# Altium project iot-gateway.PrjPcb (part 2 of 2)

## Sheet USB.SchDoc
size A4
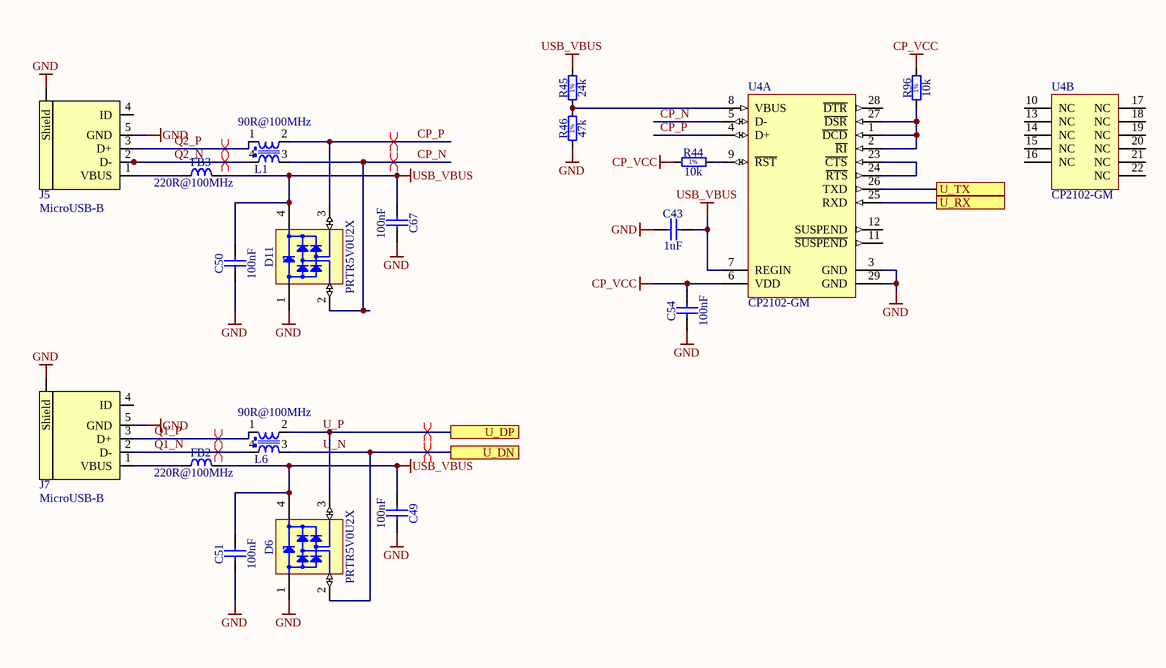
[diagram p4: USB.SchDoc]

### Parts
(Parts that share a designator on the sheet are numbered #1, #2 ... from top to bottom, then left to right.)
C43#1  1uF  [CAPC1005X55N]
C49  100nF  [CAPC1005X55N]
C50  100nF  [CAPC1005X55N]
C51  100nF  [CAPC1005X55N]
C54  100nF  [CAPC1005X55N]
C67  100nF  [CAPC1005X55N]
D6  PRTR5V0U2X  [SOT190P230X110-4N]
D11  PRTR5V0U2X  [SOT190P230X110-4N]
FB2  220R@100MHz  [INDC2012X105N]
FB3  220R@100MHz  [INDC2012X105N]
J5  MicroUSB-B  [USB-Micro-B-RA-SMD-PiP]
J7  MicroUSB-B  [USB-Micro-B-RA-SMD-PiP]
L1  90R@100MHz  [IND_MURATA_DLW21S]
L6  90R@100MHz  [IND_MURATA_DLW21S]
R44  10k  [RESC1005X40N]
R45  24k  [RESC1005X40N]
R46  47k  [RESC1005X40N]
R96  10k  [RESC1005X40N]
U4  CP2102-GM  [SLAB-QFN-28-3125x3125TP_N]  (parts A,B of 2)

### Ports
U_DN, U_DP, U_RX, U_TX

### Nets
CP_VCC: C54.2 R44.1 R96.2 U4.6(VDD)
GND: C43#1.1 C49.2 C50.1 C51.1 C54.1 C67.2 D6.1(GND) D11.1(GND) J5.5(GND) J5.6(Shield) J7.5(GND) J7.6(Shield) R46.1 U4.3(GND) U4.29(GND)
USB_VBUS: C43#1.2 C49.1 C50.2 C51.2 C67.1 D6.4(VCC) D11.4(VCC) FB2.2 FB3.2 R45.2 U4.7(REGIN)
CP_N: D11.2(I/O1) L1.3 U4.5(D-)
CP_P: D11.3(I/O2) L1.2 U4.4(D+)
Q1_N: J7.2(D-) L6.4
Q1_P: J7.3(D+) L6.1
Q2_N: J5.2(D-) L1.4
Q2_P: J5.3(D+) L1.1
U_N: D6.2(I/O1) L6.3 ; port U_DN
U_P: D6.3(I/O2) L6.2 ; port U_DP
NetFB2_1: FB2.1 J7.1(VBUS)
NetFB3_1: FB3.1 J5.1(VBUS)
NetR43_2: U4.26(TXD) ; port U_TX
NetR44_2: R44.2 U4.9(~{RST})
NetR45_1: R45.1 R46.2 U4.8(VBUS)
NetR62_1: U4.25(RXD) ; port U_RX
NetR96_1: R96.1 U4.1(~{DCD}) U4.2(~{RI}) U4.27(~{DSR})
NetU4_23: U4.23(~{CTS}) U4.24(~{RTS})

Not connected (* = marked no-connect by the designer): J5 4(ID); J7 4(ID); U4 10(NC) 11(~{SUSPEND}) 12(SUSPEND) 13(NC) 14(NC) 15(NC) 16(NC) 17(NC) 18(NC) 19(NC) 20(NC) 21(NC) 22(NC) 28(~{DTR})

### Layout directives
differential pair: CP_N, CP_P, Q1_N, Q1_P, Q2_N, Q2_P, U_N, U_P

### Notes on the sheet
- (in symbol R0402_10K_1%_0.0625W_100PPM) 1%
- (in symbol R0402_24K_1%_0.0625W_100PPM) 1%
- (in symbol R0402_47K_1%_0.0625W_100PPM) 1%

### Library data of the parts
C43#1 = CC0402_1UF_16V_10%_X5R: Non-polarised capacitor; Part Description: SMD Multilayer Chip Ceramic Capacitor; Manufacturer: GENERIC; Manufacturer1 Part Number: C1005X5R1C105KT; Voltage: 16V; TC: X5R; Tolerance: ±10%; Part Number: CC0402_1UF_16V_10%_X5R; Component Kind: Standard; Component Type: Standard; Pin Count: 2; Value: 1uF; Status: Preferred; Manufacturer Part Number: CC0402_1UF_16V_10%_X5R; Case: 0402; Mounted: Yes; Socket: No; SMD: Yes; Sense: No; Manufacturer1 Example: TDK; Manufacturer1 ComponentHeight: 0.55mm; HelpURL: \\cern.ch\dfs\Applications\Altium\Datasheets\CC0402_X5R_TDK_C.pdf; Author: CERN DEM JLC; CreateDate: 2012-10-25; LatestRevisionDate: 2012-10-25
C49-C51 C54 C67 = CC0402_100NF_16V_10%_X5R: Non-polarised capacitor; Part Description: SMD Multilayer Chip Ceramic Capacitor; Manufacturer: GENERIC; Manufacturer1 Part Number: GRM155R61C104KA88D; Voltage: 16V; TC: X5R; Tolerance: ±10%; Part Number: CC0402_100NF_16V_10%_X5R; Component Kind: Standard; Component Type: Standard; Pin Count: 2; Value: 100nF; Status: None; Manufacturer Part Number: CC0402_100NF_16V_10%_X5R; Case: 0402; Mounted: Yes; Socket: No; SMD: Yes; Sense: No; Manufacturer1 Example: MURATA; Manufacturer1 ComponentHeight: 0.55mm; HelpURL: \\cern.ch\dfs\Applications\Altium\Datasheets\CC0402_X5R_MURATA_GRM.pdf; Author: CERN DEM JLC; CreateDate: 2013-12-10; LatestRevisionDate: 2013-12-10
D6 D11 = PRTR5V0U2X: Ultra Low Capacitance Double Rail-to-Rail ESD Protection Diode; Part Description: Ultra Low Capacitance (1pF) Double Rail-to-Rail ESD Protection Diode (8kV); Manufacturer: NXP SEMICONDUCTORS; Voltage: 5.5V; PressFit: No; Bonding: No; Part Number: PRTR5V0U2X; Component Kind: Standard; Component Type: Standard; Device: PRTR5V0U2X; PackageDescription: SOT143B, SOT, 1.90mm Pitch; 4 Pin, 1.30mm W X 2.90mm L X 1.10mm H body, IPC Medium Density; Manufacturer Part Number: PRTR5V0U2X; Pin Count: 4; Case: SOT143B; Mounted: Yes; Socket: No; SMD: Yes; Sense: No; ComponentHeight: 1.1mm; HelpURL: \\cern.ch\dfs\Applications\Altium\Datasheets\PRTR5V0U2X.pdf; Author: CERN DEM JLC; CreateDate: 22.03.2011; LatestRevisionDate: 22.03.2011
FB2 FB3 = IND0805_MURATA_BLM21PG221SN1D: Inductor; Part Description: SMD EMIFIL Suppression Chip Ferrite Bead; Manufacturer: MURATA; Power: 2A; Resistance: 0.05R; Tolerance: ±25%; Table: Inductors SMD; Part Number: IND0805_MURATA_BLM21PG221SN1D; Component Kind: Standard; Component Type: Standard; Pin Count: 2; Value: 220R@100MHz; Status: None; Manufacturer Part Number: BLM21PG221SN1D; Case: 0805; Mounted: Yes; Socket: No; SMD: Yes; ComponentHeight: 1.05mm; HelpURL: \\cern.ch\dfs\Applications\Altium\Datasheets\IND0402_MURATA_BLM21P.pdf; Author: CERN DEM JLC; CreateDate: 2010-01-25; LatestRevisionDate: 2010-01-25
J5 J7 = USB-Micro-B-RA-SMD-PiP: MicroUSB-B-SMT; Manufacturer: Allen Creations Corp.; Manufacturer Part Number: AJU55-BS2111-L; 2nd source part number: 609-4616-1-ND; Artikkelnr Noca: 55029020; Artikkelnr Simpro: N.A.; Part Number: USB-Micro-B-RA-SMD-PiP; Datasheet: \\hizz\pro\app9717\Datasheet\connectores\Allen Creations Corp\AJU-211.pdf; Footprint Doc: USB-Micro-B-RA-SMD-PiP; LatestRevisionDate: 2016-04-21; Pin Count: 5; Publisher: Nordic Semiconductor; Published: 2014-10-07; Value: MicroUSB-B; Note: *; Supplier: Cabcon; Supplier part number: AJU55-BS2111-L; 2nd source Supplier: Digi-Key
L1 L6 = IND_MURATA_DLW21SN900SQ2L: Inductor Common Mode; Part Description: Wire Wound Common Mode Choke Coil (DLW21S Series); Manufacturer: MURATA; Power: 330mA; Resistance: 0.35R; Tolerance: ±25%; Part Number: IND_MURATA_DLW21SN900SQ2L; Component Kind: Standard; Component Type: Standard; Pin Count: 4; Value: 90R@100MHz; Status: None; Manufacturer Part Number: DLW21SN900SQ2L; Case: 0805; Mounted: Yes; Socket: No; SMD: Yes; Sense: No; ComponentHeight: 1.4mm; HelpURL: \\cern.ch\dfs\Applications\Altium\Datasheets\IND_MURATA_DLW21S.pdf; Author: CERN DEM JLC; CreateDate: 01.07.2014; LatestRevisionDate: 01.07.2014
R44 R96 = R0402_10K_1%_0.0625W_100PPM: Resistor - 1%; Part Description: General Purpose Thick Film Chip Resistor; Manufacturer: GENERIC; Manufacturer1 Part Number: 232270671003L; TC: ±100ppm/°C; Part Number: R0402_10K_1%_0.0625W_100PPM; Component Kind: Standard; Component Type: Standard; Pin Count: 2; Value: 10k; Status: Not recommended; Power: 0.0625W; Tolerance: ±1%; Manufacturer Part Number: R0402_10K_1%_0.0625W_100PPM; Case: 0402; Mounted: Yes; Sense: No; Socket: No; SMD: Yes; Manufacturer1 Example: YAGEO PHYCOMP; Manufacturer1 ComponentHeight: 0.4mm; HelpURL: \\cern.ch\dfs\Applications\Altium\Datasheets\R0402_Phycomp_RC0402.pdf; Author: CERN DEM JLC; CreateDate: 2007-12-03; LatestRevisionDate: 2012-10-17
R45 = R0402_24K_1%_0.0625W_100PPM: Resistor - 1%; Part Description: General Purpose Thick Film Chip Resistor; Manufacturer: GENERIC; Manufacturer1 Part Number: 232270672403L; TC: ±100ppm/°C; Part Number: R0402_24K_1%_0.0625W_100PPM; Component Kind: Standard; Component Type: Standard; Pin Count: 2; Value: 24k; Status: Not recommended; Power: 0.0625W; Tolerance: ±1%; Manufacturer Part Number: R0402_24K_1%_0.0625W_100PPM; Case: 0402; Mounted: Yes; Sense: No; Socket: No; SMD: Yes; Manufacturer1 Example: YAGEO PHYCOMP; Manufacturer1 ComponentHeight: 0.4mm; HelpURL: \\cern.ch\dfs\Applications\Altium\Datasheets\R0402_Phycomp_RC0402.pdf; Author: CERN DEM JLC; CreateDate: 2007-12-03; LatestRevisionDate: 2012-10-17
R46 = R0402_47K_1%_0.0625W_100PPM: Resistor - 1%; Part Description: General Purpose Thick Film Chip Resistor; Manufacturer: GENERIC; Manufacturer1 Part Number: 232270675103L; TC: ±100ppm/°C; Part Number: R0402_47K_1%_0.0625W_100PPM; Component Kind: Standard; Component Type: Standard; Pin Count: 2; Value: 47k; Status: Not recommended; Power: 0.0625W; Tolerance: ±1%; Manufacturer Part Number: R0402_47K_1%_0.0625W_100PPM; Case: 0402; Mounted: Yes; Sense: No; Socket: No; SMD: Yes; Manufacturer1 Example: YAGEO PHYCOMP; Manufacturer1 ComponentHeight: 0.4mm; HelpURL: \\cern.ch\dfs\Applications\Altium\Datasheets\R0402_Phycomp_RC0402.pdf; Author: CERN DEM JLC; CreateDate: 2007-12-03; LatestRevisionDate: 2012-10-17
U4 = CP2102-GM: Single-Chip USB to UART Bridge, 1024 Bytes EEPROM, -40 to 85 degC, 28-pin QFN, Tube; Manufacturer: Silicon Labs; Internal Oscillator: TRUE; Sub-Family: USB Bridges; DatasheetVersion: Rev. 1.5; PackageReference: QFN-28; PackageDescription: 28-Pin Quad-Flat No-Leads Package, Body 5 x 5 mm, Pitch 0.5 mm; Supplier 1: Digi-Key; Supplier Part Number 1: 336-1160-5-ND; Supplier 2: Farnell; Supplier Part Number 2: 9282130; Supplier 3: Newark; Supplier Part Number 3: 30K5635; Supplier 4: Mouser; Supplier Part Number 4: 634-CP2102-GM; EEPROM: 1024 Bytes; Mounting Technology: Surface Mount; Code_JEDEC: MO-220; Code_IPC: J-STD-020C; PartNumber: CP2102-GM; ComponentLink1Description: Manufacturer URL; ComponentLink1URL: http://www.silabs.com/; ComponentLink2Description: Datasheet; ComponentLink2URL: http://www.silabs.com/Support%20Documents/TechnicalDocs/CP2102-9.pdf; ComponentLink3Description: Package Specification; ComponentLink3URL: http://www.silabs.com/Support%20Documents/TechnicalDocs/C8051T61x.pdf

## Sheet SUPPLY.SchDoc
size A4
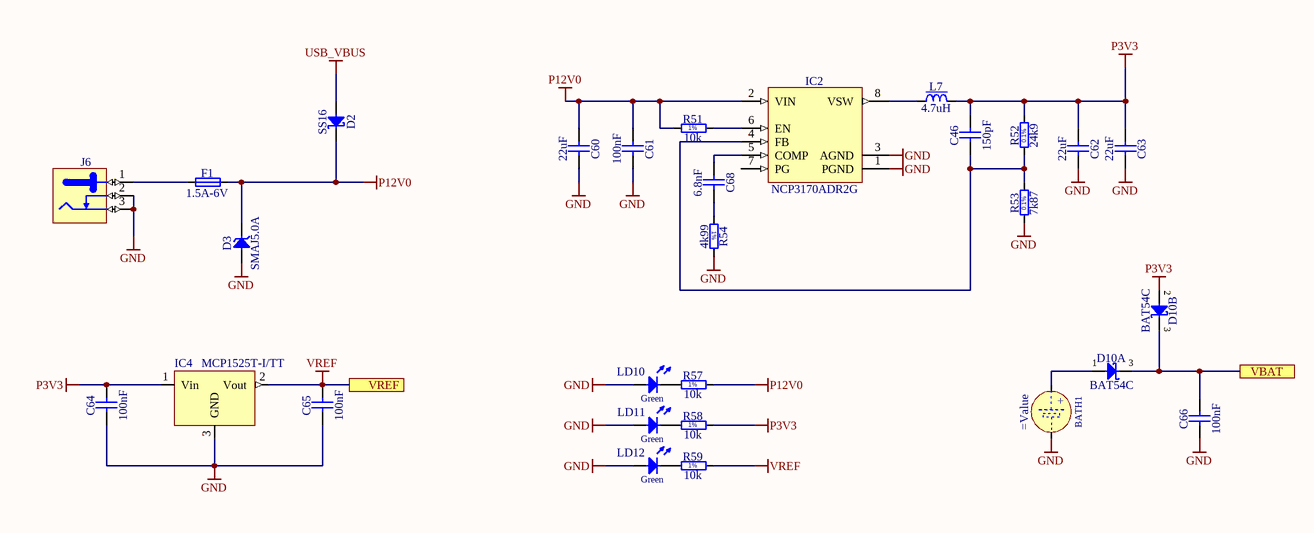
[diagram p5: SUPPLY.SchDoc]

### Parts
(Parts that share a designator on the sheet are numbered #1, #2 ... from top to bottom, then left to right.)
BATH1  (no value)  [BATH_KEYSTONE_2998]
C46  150pF  [CAPC1005X55N]
C60  22uF  [CAPC2012X135N]
C61  100nF  [CAPC1005X55N]
C62  22uF  [CAPC2012X135N]
C63  22uF  [CAPC2012X135N]
C64  100nF  [CAPC1005X55N]
C65  100nF  [CAPC1005X55N]
C66  100nF  [CAPC1005X55N]
C68  6.8nF  [CAPC1608X87N]
D2#2  SS16  [DIOM5127X229N]
D3  SMAJ5.0A  [DIOM5226X262N]
D10  BAT54C  [SOT95P240X130-3N]  (parts A,B of 2)
F1  1.5A-6V  [FUSRC4632X90N]
IC2  NCP3170ADR2G  [SOIC127P600X175-8N]
IC4  MCP1525T-I/TT  [SOT95P251X112-3N]
J6  Jack  [CLIFF_FC68148(DC-10A)]  (value not drawn)
L7  4.7uH  [INDM5552X200N]
LD10  Green  [LED_OSRAM_LGL29K]  (value not drawn)
LD11  Green  [LED_OSRAM_LGL29K]  (value not drawn)
LD12  Green  [LED_OSRAM_LGL29K]  (value not drawn)
R51  10k  [RESC1005X40N]
R52  24k9  [RESC1608X55N]
R53  7k87  [RESC1608X55N]
R54  4k99  [RESC1608X55N]
R57  10k  [RESC1005X40N]
R58  10k  [RESC1005X40N]
R59  10k  [RESC1005X40N]

### Ports
VBAT, VREF

### Nets
GND: BATH1.2(MINUS) C60.2 C61.2 C62.2 C63.2 C64.1 C65.1 C66.1 D3.2(A) IC2.1(PGND) IC2.3(AGND) IC4.3(GND) J6.2 J6.3 LD10.2(A) LD11.2(A) LD12.2(A) R53.1 R54.2
P3V3: C46.2 C62.1 C63.1 C64.2 D10.2(A) IC4.1(Vin) L7.2 R52.2 R58.2
P12V0: C60.1 C61.1 D2#2.1(C) D3.1(C) F1.2 IC2.2(VIN) R51.1 R57.2
USB_VBUS: D2#2.2(A)
VREF: C65.2 IC4.2(Vout) R59.2 ; port VREF
VBAT: C66.2 D10.3(COMC) ; port VBAT
NetBATH1_1: BATH1.1(PLUS) D10.1(A)
NetC46_1: C46.1 IC2.4(FB) R52.1 R53.2
NetC68_1: C68.1 IC2.5(COMP)
NetC68_2: C68.2 R54.1
NetF1_1: F1.1 J6.1
NetIC2_6: IC2.6(EN) R51.2
NetIC2_8: IC2.8(VSW) L7.1
NetLD10_1: LD10.1(C) R57.1
NetLD11_1: LD11.1(C) R58.1
NetLD12_1: LD12.1(C) R59.1

Not connected (* = marked no-connect by the designer): IC2 7(PG)

### Notes on the sheet
- (in symbol BATH_KEYSTONE_2998) +
- (in symbol R0402_10K_1%_0.0625W_100PPM) 1%
- (in symbol R0603_4K99_1%_0.063W_50PPM) 1%
- (in symbol R0603_7K87_0.1%_0.063W_10PPM) 0.1%
- (in symbol R0603_24K9_0.1%_0.063W_10PPM) 0.1%

### Library data of the parts
BATH1 = BATH_KEYSTONE_2998: Battery Holder whit 2 Pin; Part Description: SMD Battery Holder for SR60, SR66, SR621, LR621, MC621, V364, SC621, DR13H, D377, V13AT Buttun Cell Battery; Manufacturer Part Number: 2998; PressFit: No; Part Number: BATH_KEYSTONE_2998; Component Kind: Standard; Component Type: Standard; Pin Count: 3; PackageDescription: SMD Battery Holder for MC621, V364, SC621, DR13H, D377, V13AT Coin Cells; Family: Battery; Mounted: Yes; Socket: No; SMD: No; Sense: No; Manufacturer: KEYSTONE; ComponentHeight: 3.048mm; HelpURL: \\cern.ch\dfs\Applications\Altium\Datasheets\BATH_KEYSTONE_2998.pdf; Author: CERN DEM JLC; CreateDate: 2014-07-03; LatestRevisionDate: 2014-07-03
C46 = CC0402_150PF_50V_5%_C0G: Non-polarised capacitor; Part Description: SMD Multilayer Chip Ceramic Capacitor; Manufacturer: GENERIC; Manufacturer1 Part Number: C0402C151J5GACTU; Voltage: 50V; TC: C0G/NP0; Tolerance: ±5%; Part Number: CC0402_150PF_50V_5%_C0G; Component Kind: Standard; Component Type: Standard; Pin Count: 2; Value: 150pF; Status: Preferred; Manufacturer Part Number: CC0402_150PF_50V_5%_C0G; Case: 0402; Mounted: Yes; Socket: No; SMD: Yes; Sense: No; Manufacturer1 Example: KEMET; Manufacturer1 ComponentHeight: 0.55mm; HelpURL: \\cern.ch\dfs\Applications\Altium\Datasheets\CC0805_C0G_KEMET_(Commercial Grade).pdf; Author: CERN DEM JLC; CreateDate: 2007-12-03; LatestRevisionDate: 2015-04-22
C60 C62 C63 = CC0805_22UF_16V_10%_X5R: Non-polarised capacitor; Part Description: SMD Multilayer Chip Ceramic Capacitor; Manufacturer: GENERIC; Manufacturer1 Part Number: C2012X5R1C226KT; Voltage: 16V; TC: X5R; Tolerance: ±10%; Part Number: CC0805_22UF_16V_10%_X5R; Component Kind: Standard; Component Type: Standard; Pin Count: 2; Value: 22uF; Status: Preferred; Manufacturer Part Number: CC0805_22UF_16V_10%_X5R; Case: 0805; Mounted: Yes; Socket: No; SMD: Yes; Sense: No; Manufacturer1 Example: TDK; Manufacturer1 ComponentHeight: 1.35mm; HelpURL: \\cern.ch\dfs\Applications\Altium\Datasheets\CC0805_X5R_TDK_C.pdf; Author: CERN DEM JLC; CreateDate: 2012-10-25; LatestRevisionDate: 2012-10-25
C61 C64-C66 = CC0402_100NF_16V_10%_X5R: as C49 on sheet USB; Part Number: CC0402_100NF_16V_10%_X5R; Component Kind: Standard; Component Type: Standard; Pin Count: 2; Value: 100nF; Status: None; Manufacturer Part Number: CC0402_100NF_16V_10%_X5R; Case: 0402; Mounted: Yes; Socket: No; SMD: Yes; Sense: No; Manufacturer1 Example: MURATA; Manufacturer1 ComponentHeight: 0.55mm; HelpURL: \\cern.ch\dfs\Applications\Altium\Datasheets\CC0402_X5R_MURATA_GRM.pdf; Author: CERN DEM JLC; CreateDate: 2013-12-10; LatestRevisionDate: 2013-12-10
C68 = CC0603_6.8NF_50V_5%_X7R: Non-polarised capacitor; Part Description: SMD Multilayer Chip Ceramic Capacitor; Manufacturer: GENERIC; Manufacturer1 Part Number: 223858615634; Voltage: 50V; TC: X7R; Tolerance: ±5%; Part Number: CC0603_6.8NF_50V_5%_X7R; Component Kind: Standard; Component Type: Standard; Pin Count: 2; Value: 6.8nF; Status: Preferred; Manufacturer Part Number: CC0603_6.8NF_50V_5%_X7R; Case: 0603; Mounted: Yes; Socket: No; SMD: Yes; Sense: No; Manufacturer1 Example: PHYCOMP; Manufacturer1 ComponentHeight: 0.87mm; HelpURL: \\cern.ch\dfs\Applications\Altium\Datasheets\CC0603_X7R_PHYCOMP.pdf; Author: CERN DEM JLC; CreateDate: 2007-12-03; LatestRevisionDate: 2007-12-03
D2#2 = SS16: Schottky Diode; Part Description: Surface Mount Schottky Barrier Rectifier; Manufacturer: VISHAY GENERAL SEMICONDUCTOR; Voltage: 60V; Power: 1A; PressFit: No; Bonding: No; Part Number: SS16; Component Kind: Standard; Component Type: Standard; Device: SS16; PackageDescription: DO-214-AC Molded Diode, Body 5.1x2.7mm, IPC Medium Density; Manufacturer Part Number: SS16; Pin Count: 2; Case: DO-214AC; Mounted: Yes; Socket: No; SMD: Yes; Sense: No; ComponentHeight: 2.29mm; HelpURL: \\cern.ch\dfs\Applications\Altium\Datasheets\SS16.pdf; Author: CERN DEM JLC; CreateDate: 15.07.2008; LatestRevisionDate: 23.08.2010
D3 = SMAJ5.0A: Transient Voltage Suppressor Diode (Uni-Directional); Part Description: Surface Mount Uni-directional Transient Voltage Suppressor Diode; Manufacturer: BOURNS; Voltage: 5V; Power: 400W; PressFit: No; Bonding: No; Part Number: SMAJ5.0A; Component Kind: Standard; Component Type: Standard; Device: SMAJ5.0A; PackageDescription: DO-214-AC/SMA Diode, Molded Body; 5.21mm L X 2.605mm W X 2.62mm H, IPC Medium Density; Manufacturer Part Number: SMAJ5.0A; Pin Count: 2; Case: DO-214AC; Mounted: Yes; Socket: No; SMD: Yes; Sense: No; ComponentHeight: 2.62mm; HelpURL: \\cern.ch\dfs\Applications\Altium\Datasheets\SMAJ5.0A.pdf; Author: CERN DEM MR; CreateDate: 14.07.2016; LatestRevisionDate: 14.07.2016
D10 = BAT54C: Dual Common Cathode Schottky Diodes; Part Description: Dual Common Cathode Small Signal Schottky Diode; Manufacturer: FAIRCHILD SEMICONDUCTOR; Voltage: 30V; Power: 200mA; PressFit: No; Bonding: No; Part Number: BAT54C; Component Kind: Standard; Component Type: Standard; Device: BAT54C; PackageDescription: SOT23 3-Leads, Pitch 0.95mm - Body 1.3x2.9mm, IPC Medium Density; Manufacturer Part Number: BAT54C; Pin Count: 3; Case: SOT23-3; Mounted: Yes; Socket: No; SMD: Yes; Sense: No; ComponentHeight: 1.30mm; HelpURL: \\cern.ch\dfs\Applications\Altium\Datasheets\BAT54C.pdf; Author: CERN DEM JLC; CreateDate: 2009-09-17; LatestRevisionDate: 2010-05-27
F1 = FUSR1812_TYCO-MINISMDC150F-2: Fuse; Part Description: PolySwitch® PTC Overcurrent Protection Device; Manufacturer: TYCO ELECTRONICS; PressFit: No; Part Number: FUSR1812_TYCO-MINISMDC150F-2; Component Kind: Standard; Component Type: Standard; Pin Count: 2; PackageDescription: Chip Resettable Fuse, 2-Leads, Body 4.6x3.2mm, IPC Medium Density; Family: Fuses Resettable; Mounted: Yes; Socket: No; SMD: Yes; Sense: No; Value: 1.5A-6V; Manufacturer Part Number: miniSMDC150F-2; ComponentHeight: 0.76mm; HelpURL: \\cern.ch\dfs\Applications\Altium\Datasheets\FUSR_TYCO_miniSMDC150F-2.pdf; Author: CERN DEM MR; CreateDate: 2016-09-23; LatestRevisionDate: 2016-09-23
IC2 = NCP3170ADR2G: Synchronous PWM Switching Converter; Manufacturer: ON SEMICONDUCTOR; PressFit: No; Bonding: No; Part Number: NCP3170ADR2G; Component Kind: Standard; Component Type: Standard; Device: NCP3170ADR2G; PackageDescription: SOIC 8, Pitch 1.27mm - Body 4x5mm, IPC Medium Density; Part Description: Synchronous PWM Switching Converter; Manufacturer Part Number: NCP3170ADR2G; Pin Count: 8; Case: SOIC8; Mounted: Yes; Socket: No; SMD: Yes; Sense: No; ComponentHeight: 1.75mm; Author: CERN DEM MR; HelpURL: \\cern.ch\dfs\Applications\Altium\Datasheets\NCP3170ADR2G.pdf; CreateDate: 2016-05-30; LatestRevisionDate: 2016-05-30
IC4 = REF_MCP1525: 2.5 voltage reference
J6 = CLIFF_FC68148(DC-10A): 12V /  5A, 2.1mm Diameter Pin, DC Power Socket With  Switch. DC10A Type; Part Description: 12V/5A, 2.1mm Diameter Pin, DC Power Socket With  Switch (DC10A Type); Manufacturer: CLIFF ELECTRONIC COMPONENTS; PressFit: No; Part Number: CLIFF_FC68148(DC-10A); Component Kind: Standard; Component Type: Standard; Pin Count: 3; Family: Jack; Mounted: Yes; Socket: No; SMD: No; Sense: No; Status: None; Manufacturer Part Number: FC68148 (DC-10A); ComponentHeight: 11mm; HelpURL: \\cern.ch\dfs\Applications\Altium\Datasheets\CLIFF_FC68148(DC-10A).pdf; Author: CERN DEM JLC; CreateDate: 2010-11-23; LatestRevisionDate: 2010-11-23
L7 = IND2020_4.7UH_20%_VISHAY_IHLP-2020BZ-11: Inductor With Core; Part Description: Low Profile, High Current IHLP® Inductor; Manufacturer: VISHAY DALE; Manufacturer Part Number: IHLP2020BZER4R7M11; Power: 3.2A; Resistance: 0.0813R; Tolerance: ±20%; Part Number: IND2020_4.7UH_20%_VISHAY_IHLP-2020BZ-11; Component Kind: Standard; Component Type: Standard; Pin Count: 2; Value: 4.7uH; Status: None; Case: 2020; Mounted: Yes; Socket: No; SMD: Yes; Sense: No; ComponentHeight: 2mm; HelpURL: \\cern.ch\dfs\Applications\Altium\Datasheets\IND2020_VISHAY_IHLP2020BZ-11.pdf; Author: CERN DEM JLC; CreateDate: 2014-07-23; LatestRevisionDate: 2014-07-23
LD10-LD12 = LED_OSRAM_LG L29K-G2J1-24-Z: LED Green 1C 2A; Part Description: Surface Mount Green LED (0603 Case); Manufacturer: OSRAM; PressFit: No; Bonding: No; Part Number: LED_OSRAM_LG L29K-G2J1-24-Z; Component Kind: Standard; Component Type: Standard; Color: Green; PackageDescription: Green Chip LED, 2-Leads, Body 1.7x0.8mm, IPC Medium Density; Manufacturer Part Number: LG L29K-G2J1-24-Z; Pin Count: 2; Case: 0603; Mounted: Yes; Socket: No; SMD: Yes; Sense: No; ComponentHeight: 0.67mm; HelpURL: \\cern.ch\dfs\Applications\Altium\Datasheets\LED_OSRAM_LGL29K.pdf; Author: CERN DEM JLC; CreateDate: 2012-04-24; LatestRevisionDate: 2012-04-24
R51 R57-R59 = R0402_10K_1%_0.0625W_100PPM: as R44 on sheet USB; Part Number: R0402_10K_1%_0.0625W_100PPM; Component Kind: Standard; Component Type: Standard; Pin Count: 2; Value: 10k; Status: Not recommended; Power: 0.0625W; Tolerance: ±1%; Manufacturer Part Number: R0402_10K_1%_0.0625W_100PPM; Case: 0402; Mounted: Yes; Sense: No; Socket: No; SMD: Yes; Manufacturer1 Example: YAGEO PHYCOMP; Manufacturer1 ComponentHeight: 0.4mm; HelpURL: \\cern.ch\dfs\Applications\Altium\Datasheets\R0402_Phycomp_RC0402.pdf; Author: CERN DEM JLC; CreateDate: 2007-12-03; LatestRevisionDate: 2012-10-17
R52 = R0603_24K9_0.1%_0.063W_10PPM: Resistor - 0.1%; Part Description: Thin Film Chip Resistor; Manufacturer: GENERIC; Manufacturer1 Part Number: RN73C1J24K9BTDF; Power: 0.063W; TC: ±10ppm; Part Number: R0603_24K9_0.1%_0.063W_10PPM; Component Kind: Standard; Component Type: Standard; Pin Count: 2; Value: 24k9; Status: Not recommended; Tolerance: ±0.1%; Manufacturer Part Number: R0603_24K9_0.1%_0.063W_10PPM; Case: 0603; Mounted: Yes; Sense: No; Socket: No; SMD: Yes; Manufacturer1 Example: TYCO HOLSWORTHY; Manufacturer1 ComponentHeight: 0.5mm; HelpURL: \\cern.ch\dfs\Applications\Altium\Datasheets\R0603_Tyco_RN73.pdf; Author: CERN DEM JLC; CreateDate: 2007-12-03; LatestRevisionDate: 2008-03-13
R53 = R0603_7K87_0.1%_0.063W_10PPM: Resistor - 0.1%; Part Description: Thin Film Chip Resistor; Manufacturer: GENERIC; Manufacturer1 Part Number: RN73C1J7K87BTDF; Power: 0.063W; TC: ±10ppm; Part Number: R0603_7K87_0.1%_0.063W_10PPM; Component Kind: Standard; Component Type: Standard; Pin Count: 2; Value: 7k87; Status: Not recommended; Tolerance: ±0.1%; Manufacturer Part Number: R0603_7K87_0.1%_0.063W_10PPM; Case: 0603; Mounted: Yes; Sense: No; Socket: No; SMD: Yes; Manufacturer1 Example: TYCO HOLSWORTHY; Manufacturer1 ComponentHeight: 0.5mm; HelpURL: \\cern.ch\dfs\Applications\Altium\Datasheets\R0603_Tyco_RN73.pdf; Author: CERN DEM JLC; CreateDate: 2007-12-03; LatestRevisionDate: 2008-03-13
R54 = R0603_4K99_1%_0.063W_50PPM: Resistor - 1%; Part Description: General Purpose Thick Film Chip Resistor; Manufacturer: GENERIC; Manufacturer1 Part Number: CPF0603F4K99C1; Power: 0.1W; TC: ±50ppm/°C; Part Number: R0603_4K99_1%_0.063W_50PPM; Component Kind: Standard; Component Type: Standard; Pin Count: 2; Value: 4k99; Status: None; Tolerance: ±1%; Manufacturer Part Number: R0603_4K99_1%_0.063W_50PPM; Case: 0603; Mounted: Yes; Sense: No; Socket: No; SMD: Yes; Manufacturer1 Example: TYCO NEOHM; Manufacturer1 ComponentHeight: 0.55mm; HelpURL: \\cern.ch\dfs\Applications\Altium\Datasheets\R0603_TYCO_CPF.pdf; Author: CERN DEM JLC; CreateDate: 2010-05-20; LatestRevisionDate: 2010-05-20

## Sheet ISM.SchDoc
size A4
Used 4 times, as channels U_ISM_0, U_ISM_1, U_ISM_2, U_ISM_3. Parts and nets are listed once, with the designators drawn on the sheet.
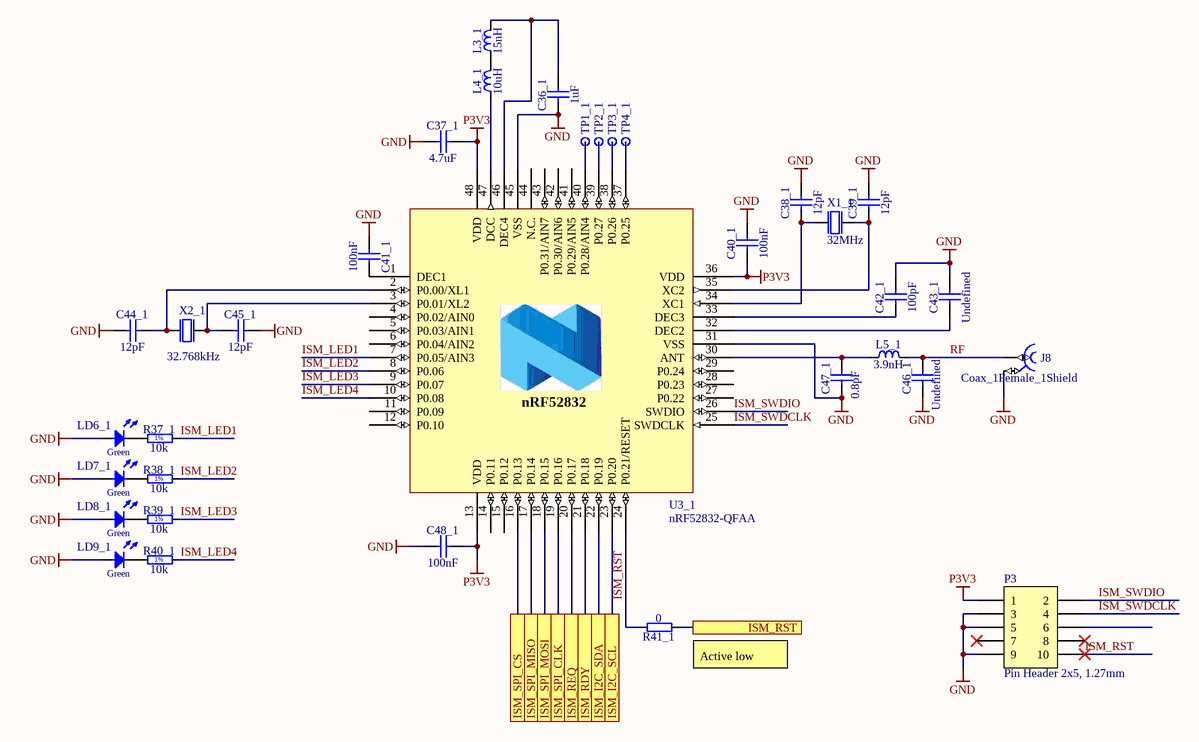
[diagram p6: ISM.SchDoc]

### Parts
C36_1  1uF  [CAPC1005X55N]
C37_1  4.7uF  [CAPC1709X95N]
C38_1  12pF  [CAPC1005X55N]
C39_1  12pF  [CAPC1005X55N]
C40_1  100nF  [CAPC1005X55N]
C41_1  100nF  [CAPC1005X55N]
C42_1  100pF  [CAPC1005X55N]
C43_1  Undefined  [CAPC1005X55N]
C44_1  12pF  [CAPC1005X55N]
C45_1  12pF  [CAPC1005X55N]
C46_1  Undefined  [CAPC1005X55N]
C47_1  0.8pF  [CAPC1005X55N]
C48_1  100nF  [CAPC1005X55N]
J8  Coax_1Female_1Shield  [HUBER-SUHNER_85_MMCX-50-0-1/111_OE]
L3_1  15nH  [INDC1005X55N]
L4_1  10uH  [INDC1005X55N]
L5_1  3.9nH  [INDC1005X55N]
LD6_1  Green  [LED_OSRAM_LGL29K]  (value not drawn)
LD7_1  Green  [LED_OSRAM_LGL29K]  (value not drawn)
LD8_1  Green  [LED_OSRAM_LGL29K]  (value not drawn)
LD9_1  Green  [LED_OSRAM_LGL29K]  (value not drawn)
P3  Pin Header 2x5, 1.27mm  [HDR_2x5-SMD-1.27mm-K]
R37_1  10k  [RESC1005X40N]
R38_1  10k  [RESC1005X40N]
R39_1  10k  [RESC1005X40N]
R40_1  10k  [RESC1005X40N]
R41_1  0  [RESC1005X40N]
TP1_1  Test Point  [TPS127]  (value not drawn)
TP2_1  Test Point  [TPS127]  (value not drawn)
TP3_1  Test Point  [TPS127]  (value not drawn)
TP4_1  Test Point  [TPS127]  (value not drawn)
U3_1  nRF52832-QFAA  [QFN40P600X600X90-48N]
X1_1  32MHz  [BT-XTAL_2016]
X2_1  32.768kHz  [XTAL_3215]

### Ports
ISM_I2C_SCL, ISM_I2C_SDA, ISM_RDY, ISM_REQ, ISM_RST, ISM_SPI_CLK, ISM_SPI_CS, ISM_SPI_MISO, ISM_SPI_MOSI

### Nets
GND: C36_1.1 C37_1.1 C38_1.2 C39_1.2 C40_1.2 C41_1.1 C42_1.2 C43_1.2 C44_1.1 C45_1.2 C46_1.1 C47_1.1 C48_1.1 J8.2 LD6_1.2(A) LD7_1.2(A) LD8_1.2(A) LD9_1.2(A) P3.3 P3.5 P3.9 U3_1.31(VSS) U3_1.45(VSS) U3_1.49(GND) X1_1.2(GND) X1_1.4(GND)
P3V3: C37_1.2 C40_1.1 C48_1.2 P3.1 U3_1.13(VDD) U3_1.36(VDD) U3_1.48(VDD)
ISM_I2C_SCL: U3_1.23(P0.20) ; port ISM_I2C_SCL
ISM_I2C_SDA: U3_1.22(P0.19) ; port ISM_I2C_SDA
ISM_LED1: R37_1.2 U3_1.7(P0.05/AIN3)
ISM_LED2: R38_1.2 U3_1.8(P0.06)
ISM_LED3: R39_1.2 U3_1.9(P0.07)
ISM_LED4: R40_1.2 U3_1.10(P0.08)
ISM_RDY: U3_1.21(P0.18) ; port ISM_RDY
ISM_REQ: U3_1.20(P0.17) ; port ISM_REQ
ISM_RST: P3.10 R41_1.2 U3_1.24(P0.21/RESET)
ISM_RST: R41_1.1 ; port ISM_RST  [a separate net that carries the same name]
ISM_SPI_CLK: U3_1.19(P0.16) ; port ISM_SPI_CLK
ISM_SPI_CS: U3_1.16(P0.13) ; port ISM_SPI_CS
ISM_SPI_MISO: U3_1.17(P0.14) ; port ISM_SPI_MISO
ISM_SPI_MOSI: U3_1.18(P0.15) ; port ISM_SPI_MOSI
ISM_SWDCLK: P3.4 U3_1.25(SWDCLK)
ISM_SWDIO: P3.2 U3_1.26(SWDIO)
RF: C46_1.2 J8.1 L5_1.2
NetC36_1_2: C36_1.2 L3_1.2 U3_1.46(DEC4)
NetC38_1_1: C38_1.1 U3_1.34(XC1) X1_1.1(inp)
NetC39_1_1: C39_1.1 U3_1.35(XC2) X1_1.3(out)
NetC41_1_2: C41_1.2 U3_1.1(DEC1)
NetC42_1_1: C42_1.1 U3_1.33(DEC3)
NetC43_1_1: C43_1.1 U3_1.32(DEC2)
NetC44_1_2: C44_1.2 U3_1.2(P0.00/XL1) X2_1.1(inp)
NetC45_1_1: C45_1.1 U3_1.3(P0.01/XL2) X2_1.2(out)
NetC47_1_2: C47_1.2 L5_1.1 U3_1.30(ANT)
NetL3_1_1: L3_1.1 L4_1.2
NetL4_1_1: L4_1.1 U3_1.47(DCC)
NetLD6_1_1: LD6_1.1(C) R37_1.1
NetLD7_1_1: LD7_1.1(C) R38_1.1
NetLD8_1_1: LD8_1.1(C) R39_1.1
NetLD9_1_1: LD9_1.1(C) R40_1.1
NetTP1_1_1: TP1_1.1 U3_1.40(P0.28/AIN4)
NetTP2_1_1: TP2_1.1 U3_1.39(P0.27)
NetTP3_1_1: TP3_1.1 U3_1.38(P0.26)
NetTP4_1_1: TP4_1.1 U3_1.37(P0.25)

Not connected (* = marked no-connect by the designer): P3 6 7* 8*; U3_1 4(P0.02/AIN0) 5(P0.03/AIN1) 6(P0.04/AIN2) 11(P0.09) 12(P0.10) 14(P0.11) 15(P0.12) 27(P0.22) 28(P0.23) 29(P0.24) 41(P0.29/AIN5) 42(P0.30/AIN6) 43(P0.31/AIN7) 44(N.C.)

### Channels
U_ISM_0: designators C36_1=C33#1 C37_1=C37_1_U_ISM_0 C38_1=C40#2 C39_1=C41#1 C40_1=C35#1 C41_1=C36#2 C42_1=C42 C43_1=C43#2 C44_1=C37#2 C45_1=C38#2 C46_1=C44#1 C47_1=C47_1_U_ISM_0 C48_1=C39#2 J8=J8_U_ISM_0 L3_1=L3_1_U_ISM_0 L4_1=L4_1_U_ISM_0 L5_1=L5_1_U_ISM_0 LD6_1=LD6_1_U_ISM_0 LD7_1=LD7_1_U_ISM_0 LD8_1=LD8_1_U_ISM_0 LD9_1=LD9_1_U_ISM_0 P3=P3_U_ISM_0 R37_1=R21#2 R38_1=R22#1 R39_1=R23#1 R40_1=R24#1 R41_1=R25#2 TP1_1=TP1#2 TP2_1=TP2#2 TP3_1=TP3 TP4_1=TP4 U3_1=U3 X1_1=X1_1_U_ISM_0 X2_1=X2_1_U_ISM_0; ports ISM_I2C_SCL=I2C1_SCL ISM_I2C_SDA=I2C1_SDA ISM_RDY=ISM0_RDY ISM_REQ=ISM0_REQ ISM_RST=ISM0_RST ISM_SPI_CLK=SPI3_SCK ISM_SPI_CS=SPI3_NSS ISM_SPI_MISO=SPI3_MISO ISM_SPI_MOSI=SPI3_MOSI
U_ISM_1: designators end in _U_ISM_1; ports ISM_I2C_SCL=I2C1_SCL ISM_I2C_SDA=I2C1_SDA ISM_RDY=ISM1_RDY ISM_REQ=ISM1_REQ ISM_RST=ISM1_RST ISM_SPI_CLK=SPI2_SCK ISM_SPI_CS=SPI2_NSS ISM_SPI_MISO=SPI2_MISO ISM_SPI_MOSI=SPI2_MOSI
U_ISM_2: designators end in _U_ISM_2; ports ISM_I2C_SCL=I2C1_SCL ISM_I2C_SDA=I2C1_SDA ISM_RDY=ISM2_RDY ISM_REQ=ISM2_REQ ISM_RST=ISM2_RST ISM_SPI_CLK=SPI1_SCK ISM_SPI_CS=SPI1_NSS ISM_SPI_MISO=SPI1_MISO ISM_SPI_MOSI=SPI1_MOSI
U_ISM_3: designators end in _U_ISM_3; ports ISM_I2C_SCL=I2C1_SCL ISM_I2C_SDA=I2C1_SDA ISM_RDY=ISM3_RDY ISM_REQ=ISM3_REQ ISM_RST=ISM3_RST ISM_SPI_CLK=SPI4_SCK ISM_SPI_CS=SPI4_NSS ISM_SPI_MISO=SPI4_MISO ISM_SPI_MOSI=SPI4_MOSI

### Notes on the sheet
- (near R41_1) Active low
- (in symbol nRF52832-QFAA) nRF52832
- (in symbol R0402_10K_1%_0.0625W_100PPM) 1%

### Library data of the parts
C36_1 = CC0402_1UF_16V_10%_X5R: as C43#1 on sheet USB; Part Number: CC0402_1UF_16V_10%_X5R; Component Kind: Standard; Component Type: Standard; Pin Count: 2; Value: 1uF; Status: Preferred; Manufacturer Part Number: CC0402_1UF_16V_10%_X5R; Case: 0402; Mounted: Yes; Socket: No; SMD: Yes; Sense: No; Manufacturer1 Example: TDK; Manufacturer1 ComponentHeight: 0.55mm; HelpURL: \\cern.ch\dfs\Applications\Altium\Datasheets\CC0402_X5R_TDK_C.pdf; Author: CERN DEM JLC; CreateDate: 2012-10-25; LatestRevisionDate: 2012-10-25
C37_1 = CC0603_4.7UF_16V_10%_X5R: Non-polarised capacitor; Part Description: SMD Multilayer Chip Ceramic Capacitor; Manufacturer: GENERIC; Manufacturer1 Part Number: EMK107ABJ475KA-T; Voltage: 16V; TC: X5R; Tolerance: ±10%; Part Number: CC0603_4.7UF_16V_10%_X5R; Component Kind: Standard; Component Type: Standard; Pin Count: 2; Value: 4.7uF; Status: None; Manufacturer Part Number: CC0603_4.7UF_16V_10%_X5R; Case: 0603; Mounted: Yes; Socket: No; SMD: Yes; Sense: No; Manufacturer1 Example: TAIYO YUDEN; Manufacturer1 ComponentHeight: 0.95mm; HelpURL: \\cern.ch\dfs\Applications\Altium\Datasheets\CC0603_X7R_TAIYO-YUDEN_HIGH-VALUE.pdf; Author: CERN DEM JLC; CreateDate: 2013-12-16; LatestRevisionDate: 2014-09-16
C38_1 C39_1 C44_1 C45_1 = CC0402_12PF_50V_5%_C0G: Non-polarised capacitor; Part Description: SMD Multilayer Chip Ceramic Capacitor; Manufacturer: GENERIC; Manufacturer1 Part Number: C0402C120J5GACTU; Voltage: 50V; TC: C0G/NP0; Tolerance: ±5%; Part Number: CC0402_12PF_50V_5%_C0G; Component Kind: Standard; Component Type: Standard; Pin Count: 2; Value: 12pF; Status: Preferred; Manufacturer Part Number: CC0402_12PF_50V_5%_C0G; Case: 0402; Mounted: Yes; Socket: No; SMD: Yes; Sense: No; Manufacturer1 Example: KEMET; Manufacturer1 ComponentHeight: 0.55mm; HelpURL: \\cern.ch\dfs\Applications\Altium\Datasheets\CC0805_C0G_KEMET_(Commercial Grade).pdf; Author: CERN DEM JLC; CreateDate: 2016-10-04; LatestRevisionDate: 2016-10-04
C40_1 C41_1 C48_1 = CC0402_100NF_16V_10%_X5R: as C49 on sheet USB; Part Number: CC0402_100NF_16V_10%_X5R; Component Kind: Standard; Component Type: Standard; Pin Count: 2; Value: 100nF; Status: None; Manufacturer Part Number: CC0402_100NF_16V_10%_X5R; Case: 0402; Mounted: Yes; Socket: No; SMD: Yes; Sense: No; Manufacturer1 Example: MURATA; Manufacturer1 ComponentHeight: 0.55mm; HelpURL: \\cern.ch\dfs\Applications\Altium\Datasheets\CC0402_X5R_MURATA_GRM.pdf; Author: CERN DEM JLC; CreateDate: 2013-12-10; LatestRevisionDate: 2013-12-10
C42_1 = CC0402_100PF_50V_5%_C0G: Non-polarised capacitor; Part Description: SMD Multilayer Chip Ceramic Capacitor; Manufacturer: GENERIC; Manufacturer1 Part Number: C0402C101J5GACTU; Voltage: 50V; TC: C0G/NP0; Tolerance: ±5%; Part Number: CC0402_100PF_50V_5%_C0G; Component Kind: Standard; Component Type: Standard; Pin Count: 2; Value: 100pF; Status: Preferred; Manufacturer Part Number: CC0402_100PF_50V_5%_C0G; Case: 0402; Mounted: Yes; Socket: No; SMD: Yes; Sense: No; Manufacturer1 Example: KEMET; Manufacturer1 ComponentHeight: 0.55mm; HelpURL: \\cern.ch\dfs\Applications\Altium\Datasheets\CC0805_C0G_KEMET_(Commercial Grade).pdf; Author: CERN DEM JLC; CreateDate: 2007-12-03; LatestRevisionDate: 2015-04-22
C43_1 C46_1 = CC0402_NO-VALUE: Non-polarised capacitor; Part Description: Reserved Footprint For 0402(1005) Chip Ceramic Capacitor; Mounted: No; Part Number: CC0402_NO-VALUE; Component Kind: Standard; Component Type: Standard; Pin Count: 2; Value: Undefined; Status: None; Manufacturer: Undefined; Manufacturer Part Number: CC0402_NO-VALUE; Case: 0402; Socket: No; SMD: Yes; Sense: No; Manufacturer1 ComponentHeight: 0.55mm; HelpURL: Undefined; Author: CERN DEM JLC; CreateDate: 2014-01-14; LatestRevisionDate: 2014-01-14
C47_1 = CC0402_NO-VALUE: Non-polarised capacitor; Part Description: Reserved Footprint For 0402(1005) Chip Ceramic Capacitor; Value: Undefined; Mounted: No; Part Number: CC0402_NO-VALUE; Component Kind: Standard; Component Type: Standard; Pin Count: 2; Status: None; Manufacturer: Undefined; Manufacturer Part Number: CC0402_NO-VALUE; Case: 0402; Socket: No; SMD: Yes; Sense: No; Manufacturer1 ComponentHeight: 0.55mm; HelpURL: Undefined; Author: CERN DEM JLC; CreateDate: 2014-01-14; LatestRevisionDate: 2014-01-14
J8 = HUBER-SUHNER_85_MMCX-50-0-1/111_OE: Part Description: MMCX 50 Ohms Right Angle PCB Jack; Manufacturer: HUBER+SUHNER; PressFit: No; Part Number: HUBER-SUHNER_85_MMCX-50-0-1/111_OE; Component Kind: Standard; Component Type: Standard; Pin Count: 2; Family: MMCX; Mounted: Yes; Socket: No; SMD: No; Sense: No; Status: None; Manufacturer Part Number: 85_MMCX-50-0-1/111_OE; ComponentHeight: 9.6mm; HelpURL: \\cern.ch\dfs\Applications\Altium\Datasheets\HUBER-SUHNER_85_MMCX-50-0-1-111_OE.pdf; Author: CERN DEM JLC; CreateDate: 2014-11-06; LatestRevisionDate: 2014-11-06
L3_1 L4_1 L5_1 = IND0402_MURATA_BLM15HB221SN1: Inductor; Part Description: SMD EMIFIL Suppression Chip Ferrite Bead; Manufacturer: MURATA; Value: 220R@100MHz; Power: 250mA; Resistance: 1R; Tolerance: ±25%; Part Number: IND0402_MURATA_BLM15HB221SN1; Component Kind: Standard; Component Type: Standard; Pin Count: 2; Status: None; Manufacturer Part Number: BLM15HB221SN1; Case: 0402; Mounted: Yes; Socket: No; SMD: Yes; Sense: No; ComponentHeight: 0.55mm; HelpURL: \\cern.ch\dfs\Applications\Altium\Datasheets\IND0402_MURATA_BLM15H.pdf; Author: CERN DEM JLC; CreateDate: 2009-06-23; LatestRevisionDate: 2009-06-23
LD6_1 LD7_1 LD8_1 LD9_1 = LED_OSRAM_LG L29K-G2J1-24-Z: as LD10 on sheet SUPPLY; Part Number: LED_OSRAM_LG L29K-G2J1-24-Z; Component Kind: Standard; Component Type: Standard; Color: Green; PackageDescription: Green Chip LED, 2-Leads, Body 1.7x0.8mm, IPC Medium Density; Manufacturer Part Number: LG L29K-G2J1-24-Z; Pin Count: 2; Case: 0603; Mounted: Yes; Socket: No; SMD: Yes; Sense: No; ComponentHeight: 0.67mm; HelpURL: \\cern.ch\dfs\Applications\Altium\Datasheets\LED_OSRAM_LGL29K.pdf; Author: CERN DEM JLC; CreateDate: 2012-04-24; LatestRevisionDate: 2012-04-24
P3 = Pin Header 2x5 SMD, 1.27mm, KS: Pin Header 2x5, 1.27mm (50mil), SMD, Keying Shroud; Manufacturer: WCON; Manufacturer Part Number: 3132-10MS0BK00R1; 2nd source part number: FTSH-105-01-F-DV-K; Artikkelnr Noca: 55010009; Artikkelnr Simpro: N.A.; Part Number: Pin Header 2x5 SMD, 1.27mm, KS; Datasheet: \\hizz\pro\app9717\Datasheet\connectores\W-CON\3132-XXMXXBK00XX.pdf; Footprint Doc: HDR_2x5-SMD-1.27mm; LatestRevisionDate: 2016-04-21; Pin Count: 10; Publisher: Nordic Semiconductor; Published: 2016-01-22; Value: Pin Header 2x5, 1.27mm; Note: *; Supplier: Cabcon; Supplier part number: 3132-10MS0BK00R1; 2nd source Supplier: Samtec
R37_1 R38_1 R39_1 R40_1 = R0402_10K_1%_0.0625W_100PPM: as R44 on sheet USB; Part Number: R0402_10K_1%_0.0625W_100PPM; Component Kind: Standard; Component Type: Standard; Pin Count: 2; Value: 10k; Status: Not recommended; Power: 0.0625W; Tolerance: ±1%; Manufacturer Part Number: R0402_10K_1%_0.0625W_100PPM; Case: 0402; Mounted: Yes; Sense: No; Socket: No; SMD: Yes; Manufacturer1 Example: YAGEO PHYCOMP; Manufacturer1 ComponentHeight: 0.4mm; HelpURL: \\cern.ch\dfs\Applications\Altium\Datasheets\R0402_Phycomp_RC0402.pdf; Author: CERN DEM JLC; CreateDate: 2007-12-03; LatestRevisionDate: 2012-10-17
R41_1 = R0402_0R_JUMPER: Resistor; Part Description: 1A (0.05R Max DC Resistance) Zero Ohm Jumper; Manufacturer: GENERIC; Manufacturer1 Part Number: 232270591001L; Part Number: R0402_0R_JUMPER; Component Kind: Standard; Component Type: Standard; Pin Count: 2; Value: 0; Status: Not recommended; Manufacturer Part Number: R0402_0R_JUMPER; Case: 0402; Mounted: Yes; Sense: No; Socket: No; SMD: Yes; Manufacturer1 Example: YAGEO PHYCOMP; Manufacturer1 ComponentHeight: 0.4mm; HelpURL: \\cern.ch\dfs\Applications\Altium\Datasheets\R0402_Phycomp_RC0402.pdf; Author: CERN DEM JLC; CreateDate: 2007-12-03; LatestRevisionDate: 2012-10-17
TP1_1 TP2_1 TP3_1 TP4_1 = SMD_PAD_1.27X1.27MM: Part Description: 1.27mm x 1.27mm PCB Copper Area (SMD Test Point); Mounted: No; Part Number: SMD_PAD_1.27X1.27MM; Component Kind: Standard (No BOM); Component Type: Standard (No BOM); Pin Count: 1; Family: Test Point; Socket: No; SMD: Yes; Sense: No; Status: None; ComponentHeight: 0mm; HelpURL: Undefined; Author: CERN DEM JLC; CreateDate: 2008-01-12; LatestRevisionDate: 2008-01-12; PackageDescription: 1.27mm x 1.27mm PCB Copper Area (SMD Test Point)
U3_1 = nRF52832-QFAA: Multi-protocol Bluetooth Low Energy and 2.4GHz proprietary system-on-chip; Manufacturer: Nordic Semiconductor; Artikkelnr Noca: N.A.; Part Number: nRF52832-QFAA; Manufacturer Part Number: nRF52832-QFAA; Datasheet: *; LatestRevisionDate: 2014-11-26; Pin Count: 48; Publisher: Nordic Semiconductor; Published: 2014-11-26; Value: nRF52832-QFAA; Note: *; Supplier: Nordic Semiconductor; Supplier part number: *; 2nd source Supplier: *; 2nd source part number: *; Footprint Doc: QFN-48; Artikkelnr Simpro: N.A.
X1_1 = XTAL_SMD2016_32MHz_8pF_Epson: XTAL SMD 2016, 32MHz, Cl=8pF, Tol: ±10ppm, Stab: ±10ppm; Manufacturer: Epson Toyocom; Manufacturer Part Number: Q22FA12800025; Note: XTAL SMD 32.000MHz; Artikkelnr Noca: N.A.; Part Number: XTAL_SMD2016_32MHz_8pF_Epson; Datasheet: http://www.epsondevice.com/docs/qd/en/DownloadServlet?id=ID000449; LatestRevisionDate: 2014-11-27; Pin Count: 4; Publisher: Nordic Semiconductor; Published: 2012-03-09; Value: 32MHz; Supplier: Farnell; Supplier part number: 171-2806; 2nd source Supplier: *; 2nd source part number: *; Footprint Doc: XTAL_2016; Artikkelnr Simpro: N.A.
X2_1 = XTAL_FC-135 32.768k: EPSON TOYOCOM - FC-135 32.768KHZ ±20PPM,9.0PF - CRYSTAL, SM, WATCH; 2nd source part number: 127-8037; Note: XTAL SMD 32.768kHz, 3215; Artikkelnr Noca: 22019091; Artikkelnr Simpro: N.A.; Part Number: XTAL_FC-135 32.768k; Manufacturer: Epson Toyocom; Manufacturer Part Number: FC-135 32.768KHZ ±20PPM,9.0PF; Datasheet: http://www.farnell.com/datasheets/57480.pdf; LatestRevisionDate: 2014-03-27; Pin Count: 2; Publisher: Nordic Semiconductor; Published: 2010-10-18; Value: 32.768kHz; Supplier: Digi-Key; Supplier part number: FC-135 32.7680KA-AC-ND; 2nd source Supplier: Farnell; Footprint Doc: XTAL_3215

## Sheet WAKEUP.SchDoc
size A4
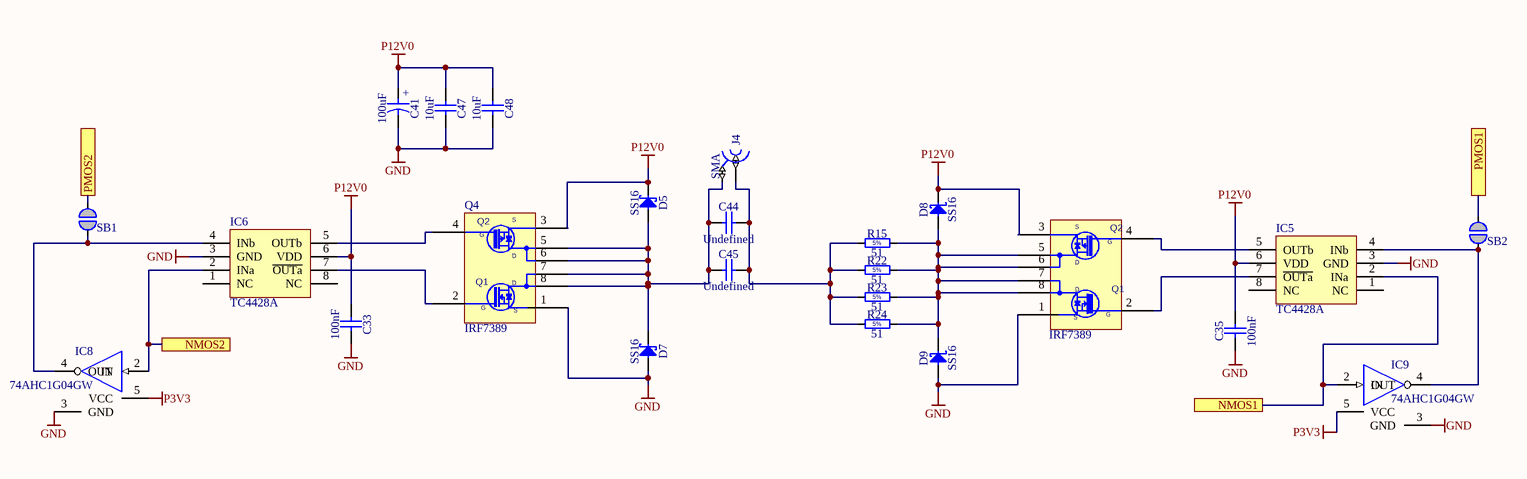
[diagram p7: WAKEUP.SchDoc]

### Parts
(Parts that share a designator on the sheet are numbered #1, #2 ... from top to bottom, then left to right.)
C33#2  100nF  [CAPC1608X87N]
C35#2  100nF  [CAPC1608X87N]
C41#2  100uF  [CAPAE660X540N]
C44#2  Undefined  [CAPC2012X135N]
C45  Undefined  [CAPC2012X135N]
C47  10uF  [CAPC3216X140N]
C48  10uF  [CAPC3216X140N]
D5  SS16  [DIOM5127X229N]
D7  SS16  [DIOM5127X229N]
D8  SS16  [DIOM5127X229N]
D9  SS16  [DIOM5127X229N]
IC5  TC4428A  [SO-8]
IC6  TC4428A  [SO-8]
IC8  74AHC1G04GW  [SOT65P212X110-5N]
IC9  74AHC1G04GW  [SOT65P212X110-5N]
J4  SMA  [HUBER-SUHNER_85_SMA-50-0-101/111_NE]
Q4  IRF7389  [SO-8]
Q5  IRF7389  [SO-8]
R15  51  [RESC6331X80N]
R22#2  51  [RESC6331X80N]
R23#2  51  [RESC6331X80N]
R24#2  51  [RESC6331X80N]
SB1  Solderbridge  [Solderbridge]  (value not drawn)  (no BOM)
SB2  Solderbridge  [Solderbridge]  (value not drawn)  (no BOM)

### Ports
NMOS1, NMOS2, PMOS1, PMOS2

### Nets
GND: C33#2.1 C35#2.1 C41#2.2 C47.2 C48.2 D7.2(A) D9.2(A) IC5.3(GND) IC6.3(GND) IC8.3(GND) IC9.3(GND) Q4.1(S-N) Q5.1(S-N)
P3V3: IC8.5(VCC) IC9.5(VCC)  [also labelled VDD]
P12V0: C33#2.2 C35#2.2 C41#2.1 C47.1 C48.1 D5.1(C) D8.1(C) IC5.6(VDD) IC6.6(VDD) Q4.3(S-P) Q5.3(S-P)
TIM8_CH1: SB2.1 ; port PMOS1
TIM8_CH2: IC5.2(INa) IC9.2(IN) ; port NMOS1
TIM8_CH3: SB1.1 ; port PMOS2
TIM8_CH4: IC6.2(INa) IC8.2(IN) ; port NMOS2
NetC44#2_1: C44#2.1 C45.1 D5.2(A) D7.1(C) J4.2 Q4.5(D-P) Q4.6(D-P) Q4.7(D-N) Q4.8(D-N)
NetC44#2_2: C44#2.2 C45.2 J4.1 R15.1 R22#2.1 R23#2.1 R24#2.1
NetD8_2: D8.2(A) D9.1(C) Q5.5(D-P) Q5.6(D-P) Q5.7(D-N) Q5.8(D-N) R15.2 R22#2.2 R23#2.2 R24#2.2
NetIC5_4: IC5.4(INb) IC9.4(OUT) SB2.2
NetIC5_5: IC5.5(OUTb) Q5.4(G-P)
NetIC5_7: IC5.7(~{OUTa}) Q5.2(G-N)
NetIC6_4: IC6.4(INb) IC8.4(OUT) SB1.2
NetIC6_5: IC6.5(OUTb) Q4.4(G-P)
NetIC6_7: IC6.7(~{OUTa}) Q4.2(G-N)

Not connected (* = marked no-connect by the designer): IC5 1(NC) 8(NC); IC6 1(NC) 8(NC)

### Notes on the sheet
- (in symbol CAE660-540_100UF_16V_20%) +
- (in symbol IRF7389) S; Q2; G; D; Q1
- (in symbol R2512_51R_5%_2W_200PPM_BOURNS_CRM2512) 5%

### Library data of the parts
C33#2 C35#2 = CC0603_100NF_50V_10%_X7R: Non-polarised capacitor; Part Description: SMD Multilayer Chip Ceramic Capacitor; Manufacturer: GENERIC; Manufacturer1 Part Number: 223858615649; Voltage: 50V; TC: X7R; Tolerance: ±10%; Part Number: CC0603_100NF_50V_10%_X7R; Component Kind: Standard; Component Type: Standard; Pin Count: 2; Value: 100nF; Status: Preferred; Manufacturer Part Number: CC0603_100NF_50V_10%_X7R; Case: 0603; Mounted: Yes; Socket: No; SMD: Yes; Sense: No; Manufacturer1 Example: PHYCOMP; Manufacturer1 ComponentHeight: 0.87mm; HelpURL: \\cern.ch\dfs\Applications\Altium\Datasheets\CC0603_X7R_PHYCOMP.pdf; Author: CERN DEM JLC; CreateDate: 2007-12-03; LatestRevisionDate: 2007-12-03
C41#2 = CAE660-540_100UF_16V_20%: Polarised capacitor; Part Description: Aluminum Electrolytic SMT Capacitor; Manufacturer: PANASONIC; Manufacturer Part Number: EEEFK1C101AP; Voltage: 16V; Tolerance: ±20%; Part Number: CAE660-540_100UF_16V_20%; Component Kind: Standard; Component Type: Standard; Pin Count: 2; Value: 100uF; Status: Not Recommended; Case: D; Mounted: Yes; Socket: No; SMD: Yes; Sense: No; ComponentHeight: 5.8mm; HelpURL: \\cern.ch\dfs\Applications\Altium\Datasheets\CAE_PANASONIC_FK.pdf; Author: CERN DEM JLC; CreateDate: 2007-12-03; LatestRevisionDate: 2014-11-05
C44#2 C45 = CC0805_NO-VALUE: Non-polarised capacitor; Part Description: Reserved Footprint For 0805(2012) Chip Ceramic Capacitor; Mounted: No; Part Number: CC0805_NO-VALUE; Component Kind: Standard; Component Type: Standard; Pin Count: 2; Value: Undefined; Status: None; Manufacturer: Undefined; Manufacturer Part Number: CC0805_NO-VALUE; Case: 0805; Socket: No; SMD: Yes; Sense: No; Manufacturer1 ComponentHeight: 1.35mm; HelpURL: Undefined; Author: CERN DEM JLC; CreateDate: 10.12.2008; LatestRevisionDate: 11.09.2013
C47 C48 = CC1206_10UF_16V_10%_X7R: Non-polarised capacitor; Part Description: SMD Multilayer Chip Ceramic Capacitor; Manufacturer: GENERIC; Manufacturer1 Part Number: C1206C106K4RAC; Voltage: 16V; TC: X7R; Tolerance: ±10%; Part Number: CC1206_10UF_16V_10%_X7R; Component Kind: Standard; Component Type: Standard; Pin Count: 2; Value: 10uF; Status: Preferred; Manufacturer Part Number: CC1206_10uF_16V_10%_X7R; Case: 1206; Mounted: Yes; Socket: No; SMD: Yes; Sense: No; Manufacturer1 Example: KEMET; Manufacturer1 ComponentHeight: 1.8mm; HelpURL: \\cern.ch\dfs\Applications\Altium\Datasheets\CC1206_X7R_KEMET.pdf; Author: CERN DEM JLC; CreateDate: 2009-04-28; LatestRevisionDate: 2009-04-28
D5 D7-D9 = SS16: as D2#2 on sheet SUPPLY; Part Number: SS16; Component Kind: Standard; Component Type: Standard; Device: SS16; PackageDescription: DO-214-AC Molded Diode, Body 5.1x2.7mm, IPC Medium Density; Manufacturer Part Number: SS16; Pin Count: 2; Case: DO-214AC; Mounted: Yes; Socket: No; SMD: Yes; Sense: No; ComponentHeight: 2.29mm; HelpURL: \\cern.ch\dfs\Applications\Altium\Datasheets\SS16.pdf; Author: CERN DEM JLC; CreateDate: 15.07.2008; LatestRevisionDate: 23.08.2010
IC5 IC6 = DRV_TC4428A: MOSFET Driver
IC8 IC9 = 74AHC1G04GW: Single Inverter Buffer; Manufacturer: NXP SEMICONDUCTORS; PressFit: No; Bonding: No; Part Number: 74AHC1G04GW; Component Kind: Standard; Component Type: Standard; Device: 74AHC1G04GW; PackageDescription: SOT353, SOT, 0.65mm Pitch, 5 pin, 1.25mm W X 2.05mm L X 1.10mm H, IPC Medium Density; Part Description: Single Inverter Buffer; Manufacturer Part Number: 74AHC1G04GW; Pin Count: 3; Case: SOT353; Mounted: Yes; Socket: No; SMD: Yes; Sense: No; ComponentHeight: 1.1mm; Author: CERN DEM JLC; HelpURL: \\cern.ch\dfs\Applications\Altium\Datasheets\74AHC1G04GW.pdf; CreateDate: 2010-03-03; LatestRevisionDate: 2010-03-03
J4 = HUBER-SUHNER_85_SMA-50-0-101/111_NE: Part Description: SMA 50 Ohms Right Angle PCB Jack; Manufacturer: HUBER+SUHNER; PressFit: No; Part Number: HUBER-SUHNER_85_SMA-50-0-101/111_NE; Component Kind: Standard; Component Type: Standard; Footprint: HUBER-SUHNER_85 SMA-50-0-101/111_NE; Pin Count: 2; Family: SMA; Mounted: Yes; Socket: No; SMD: No; Sense: No; Status: None; Manufacturer Part Number: 85_SMA-50-0-101/111_NE; ComponentHeight: 9.6mm; HelpURL: \\cern.ch\dfs\Applications\Altium\Datasheets\HUBER-SUHNER_85_SMA-50-0-101-111_NE.pdf; Author: CERN DEM JLC; CreateDate: 2010-04-20; LatestRevisionDate: 2014-11-06
R15 R22#2 R23#2 R24#2 = R2512_51R_5%_2W_200PPM_BOURNS_CRM2512: Resistor - 5%; Part Description: Pulse Resistant Power Thick Film Chip Resistor; Manufacturer: BOURNS; Manufacturer Part Number: CRM2512-JW-510ELF; Power: 2W; TC: ±200ppm/°C; Part Number: R2512_51R_5%_2W_200PPM_BOURNS_CRM2512; Component Kind: Standard; Component Type: Standard; Pin Count: 2; Value: 51; Status: None; Tolerance: ±5%; Case: 2512; Mounted: Yes; Sense: No; Socket: No; SMD: Yes; ComponentHeight: 0.8mm; HelpURL: \\cern.ch\dfs\Applications\Altium\Datasheets\R2512_BOURNS_CRM2512.pdf; Author: CERN DEM JLC; CreateDate: 2012-01-10; LatestRevisionDate: 2012-01-10
SB1 SB2 = SOLDERBRIDGE: Artikkelnr Noca: N.A.; Part Number: Solderbridge; Manufacturer: *; Manufacturer Part Number: *; Datasheet: *; LatestRevisionDate: 2009-12-14; Pin Count: 2; Publisher: Nordic Semiconductor; Published: 2009-12-14; Value: Solderbridge; Note: *; Supplier: *; Supplier part number: *; 2nd source Supplier: *; 2nd source part number: *; Footprint Doc: Solderbridge; Artikkelnr Simpro: N.A.

## Nets that join several sheets
GND: CPU (48 pins), SDRAM (14 pins), ETHERNET (21 pins), PERIPH (22 pins), USB (15 pins), SUPPLY (19 pins), U_ISM_0 (26 pins), U_ISM_1 (26 pins), U_ISM_2 (26 pins), U_ISM_3 (26 pins), WAKEUP (13 pins)
P3V3: CPU (43 pins), SDRAM (14 pins), ETHERNET (FB1.1), PERIPH (17 pins), SUPPLY (9 pins), U_ISM_0 (7 pins), U_ISM_1 (7 pins), U_ISM_2 (7 pins), U_ISM_3 (7 pins), WAKEUP (IC8.5 IC9.5)
P12V0: SUPPLY (8 pins), WAKEUP (11 pins)
USB_VBUS: USB (11 pins), SUPPLY (D2#2.2)
VREF: CPU (U1.38), SUPPLY (C65.2 IC4.2 R59.2)
A0: CPU (U1.16), SDRAM (R26.2)
A1: CPU (U1.17), SDRAM (R37.2)
A2: CPU (U1.18), SDRAM (R39.2)
A3: CPU (U1.19), SDRAM (R41.2)
A4: CPU (U1.20), SDRAM (R56.2)
A5: CPU (U1.21), SDRAM (R61.2)
A6: CPU (U1.60), SDRAM (R66.2)
A7: CPU (U1.63), SDRAM (R68.2)
A8: CPU (U1.64), SDRAM (R70.2)
A9: CPU (U1.65), SDRAM (R72.2)
A10: CPU (U1.66), SDRAM (R74.2)
A11: CPU (U1.67), SDRAM (R76.2)
A12: CPU (U1.106), SDRAM (R78.2)
BOOT: CPU (U1.166), PERIPH (R36.2 SW1.4)
BOOT_SW1: CPU (U1.58), PERIPH (R33.2 SW1.1)
BOOT_SW2: CPU (U1.56), PERIPH (R34.2 SW1.2)
BOOT_SW3: CPU (U1.44), PERIPH (R35.2 SW1.3)
D0: CPU (U1.104), SDRAM (R27.2)
D1: CPU (U1.105), SDRAM (R38.2)
D2: CPU (U1.142), SDRAM (R40.2)
D3: CPU (U1.143), SDRAM (R55.2)
D4: CPU (U1.68), SDRAM (R60.2)
D5: CPU (U1.69), SDRAM (R65.2)
D6: CPU (U1.70), SDRAM (R67.2)
D7: CPU (U1.73), SDRAM (R69.2)
D8: CPU (U1.74), SDRAM (R71.2)
D9: CPU (U1.75), SDRAM (R73.2)
D10: CPU (U1.76), SDRAM (R75.2)
D11: CPU (U1.77), SDRAM (R77.2)
D12: CPU (U1.78), SDRAM (R79.2)
D13: CPU (U1.96), SDRAM (R80.2)
D14: CPU (U1.97), SDRAM (R82.2)
D15: CPU (U1.98), SDRAM (R84.2)
ETH_CRS_DV: CPU (U1.53), ETHERNET (R13.1)
ETH_MDC: CPU (U1.33), ETHERNET (U2.13)
ETH_MDIO: CPU (U1.42), ETHERNET (R5.1 U2.12)
ETH_REF_CLK: CPU (U1.41), ETHERNET (R97.1)
ETH_RXD0: CPU (U1.54), ETHERNET (R10.1)
ETH_RXD1: CPU (U1.55), ETHERNET (R11.1)
ETH_TX_EN: CPU (U1.154), ETHERNET (U2.16)
ETH_TXD0: CPU (U1.92), ETHERNET (U2.17)
ETH_TXD1: CPU (U1.93), ETHERNET (U2.18)
EXT_GPIO0: CPU (U1.128), PERIPH (J3.11)
EXT_GPIO1: CPU (U1.129), PERIPH (J3.12)
EXT_GPIO2: CPU (U1.130), PERIPH (J3.13)
EXT_GPIO3: CPU (U1.110), PERIPH (J3.14)
EXT_GPIO4: CPU (U1.111), PERIPH (J3.15)
EXT_GPIO5: CPU (U1.99), PERIPH (J3.16)
EXT_GPIO6: CPU (U1.100), PERIPH (J3.17)
EXT_GPIO7: CPU (U1.101), PERIPH (J3.18)
EXT_GPIO8: CPU (U1.94), PERIPH (J3.19)
EXT_GPIO9: CPU (U1.95), PERIPH (J3.20)
EXT_GPIO10: CPU (U1.79), PERIPH (J3.21)
EXT_GPIO11: CPU (U1.80), PERIPH (J3.22)
FMC_BA0: CPU (U1.108), SDRAM (R81.2)
FMC_BA1: CPU (U1.109), SDRAM (R83.2)
FMC_NBL0: CPU (U1.169), SDRAM (R91.2)
FMC_NBL1: CPU (U1.170), SDRAM (R92.2)
FMC_SDCKE1: CPU (U1.84), SDRAM (R89.2)
FMC_SDCLK: CPU (U1.112), SDRAM (R90.2)
FMC_SDNCAS: CPU (U1.160), SDRAM (R87.2)
FMC_SDNE1: CPU (U1.83), SDRAM (R85.2)
FMC_SDNRAS: CPU (U1.59), SDRAM (R86.2)
FMC_SDNWE: CPU (U1.32), SDRAM (R88.2)
I2C1_SCL: CPU (R47.1 TP1#1.1 U1.164), U_ISM_0 (U3.23), U_ISM_1 (U3_1_U_ISM_1.23), U_ISM_2 (U3_1_U_ISM_2.23), U_ISM_3 (U3_1_U_ISM_3.23)
I2C1_SDA: CPU (R48.1 TP2#1.1 U1.165), U_ISM_0 (U3.22), U_ISM_1 (U3_1_U_ISM_1.22), U_ISM_2 (U3_1_U_ISM_2.22), U_ISM_3 (U3_1_U_ISM_3.22)
I2C2_SCL: CPU (IC7.6 R49.1 U1.45), PERIPH (J3.29)
I2C2_SDA: CPU (IC7.5 R50.1 U1.46), PERIPH (J3.30)
I2C3_SCL: CPU (R93.1 U1.119), PERIPH (J3.25)
I2C3_SDA: CPU (R94.1 U1.85), PERIPH (J3.26)
ISM0_RDY: CPU (U1.175), U_ISM_0 (U3.21)
ISM0_REQ: CPU (U1.174), U_ISM_0 (U3.20)
ISM0_RST: CPU (U1.167), U_ISM_0 (R25#2.1)
ISM1_RDY: CPU (U1.173), U_ISM_1 (U3_1_U_ISM_1.21)
ISM1_REQ: CPU (U1.2), U_ISM_1 (U3_1_U_ISM_1.20)
ISM1_RST: CPU (U1.168), U_ISM_1 (R41_1_U_ISM_1.1)
ISM2_RDY: CPU (U1.43), U_ISM_2 (U3_1_U_ISM_2.21)
ISM2_REQ: CPU (U1.57), U_ISM_2 (U3_1_U_ISM_2.20)
ISM2_RST: CPU (U1.13), U_ISM_2 (R41_1_U_ISM_2.1)
ISM3_RDY: CPU (U1.7), U_ISM_3 (U3_1_U_ISM_3.21)
ISM3_REQ: CPU (U1.152), U_ISM_3 (U3_1_U_ISM_3.20)
ISM3_RST: CPU (U1.28), U_ISM_3 (R41_1_U_ISM_3.1)
LED1: CPU (U1.86), PERIPH (R28.2)
LED2: CPU (U1.87), PERIPH (R29.2)
LED3: CPU (U1.88), PERIPH (R30.2)
LED4: CPU (U1.11), PERIPH (R31.2)
LED5: CPU (U1.12), PERIPH (R32.2)
NetR43_2: CPU (R43.2), USB (U4.26)
NetR62_1: CPU (R62.1), USB (U4.25)
RST: CPU (D2#1.3 D4.1 P2.10 U1.31), ETHERNET (U2.15), PERIPH (C34.1 PB2.1 R21#1.1)
SDIO_CLK: CPU (U1.141), PERIPH (J2.5)
SDIO_CMD: CPU (U1.144), PERIPH (J2.3 R18.1)
SDIO_D0: CPU (U1.117), PERIPH (J2.7 R17.1)
SDIO_D1: CPU (U1.118), PERIPH (J2.8 R16.1)
SDIO_D2: CPU (U1.139), PERIPH (J2.1 R20.1)
SDIO_D3: CPU (U1.140), PERIPH (J2.2 R19.1)
SPI1_MISO: CPU (U1.52), U_ISM_2 (U3_1_U_ISM_2.17)
SPI1_MOSI: CPU (U1.163), U_ISM_2 (U3_1_U_ISM_2.18)
SPI1_NSS: CPU (U1.50), U_ISM_2 (U3_1_U_ISM_2.16)
SPI1_SCK: CPU (U1.51), U_ISM_2 (U3_1_U_ISM_2.19)
SPI2_MISO: CPU (U1.34), U_ISM_1 (U3_1_U_ISM_1.17)
SPI2_MOSI: CPU (U1.35), U_ISM_1 (U3_1_U_ISM_1.18)
SPI2_NSS: CPU (U1.131), U_ISM_1 (U3_1_U_ISM_1.16)
SPI2_SCK: CPU (U1.132), U_ISM_1 (U3_1_U_ISM_1.19)
SPI3_MISO: CPU (U1.162), U_ISM_0 (U3.17)
SPI3_MOSI: CPU (U1.150), U_ISM_0 (U3.18)
SPI3_NSS: CPU (U1.138), U_ISM_0 (U3.16)
SPI3_SCK: CPU (U1.161), U_ISM_0 (U3.19)
SPI4_MISO: CPU (U1.4), U_ISM_3 (U3_1_U_ISM_3.17)
SPI4_MOSI: CPU (U1.5), U_ISM_3 (U3_1_U_ISM_3.18)
SPI4_NSS: CPU (U1.3), U_ISM_3 (U3_1_U_ISM_3.16)
SPI4_SCK: CPU (U1.1), U_ISM_3 (U3_1_U_ISM_3.19)
SPI5_MISO: CPU (U1.26), PERIPH (J3.7)
SPI5_MOSI: CPU (U1.27), PERIPH (J3.6)
SPI5_NSS: CPU (U1.24), PERIPH (J3.5)
SPI5_SCK: CPU (U1.25), PERIPH (J3.8)
TIM8_CH1: CPU (U1.115), WAKEUP (SB2.1)
TIM8_CH2: CPU (U1.116), WAKEUP (IC5.2 IC9.2)
TIM8_CH3: CPU (U1.176), WAKEUP (SB1.1)
TIM8_CH4: CPU (U1.133), WAKEUP (IC6.2 IC8.2)
U_N: CPU (R64.1), USB (D6.2 L6.3)
U_P: CPU (R63.2), USB (D6.3 L6.2)
USART2_RX: CPU (U1.47), PERIPH (J3.27)
USART2_TX: CPU (U1.147), PERIPH (J3.28)
VBAT: CPU (U1.6), SUPPLY (C66.2 D10.3)